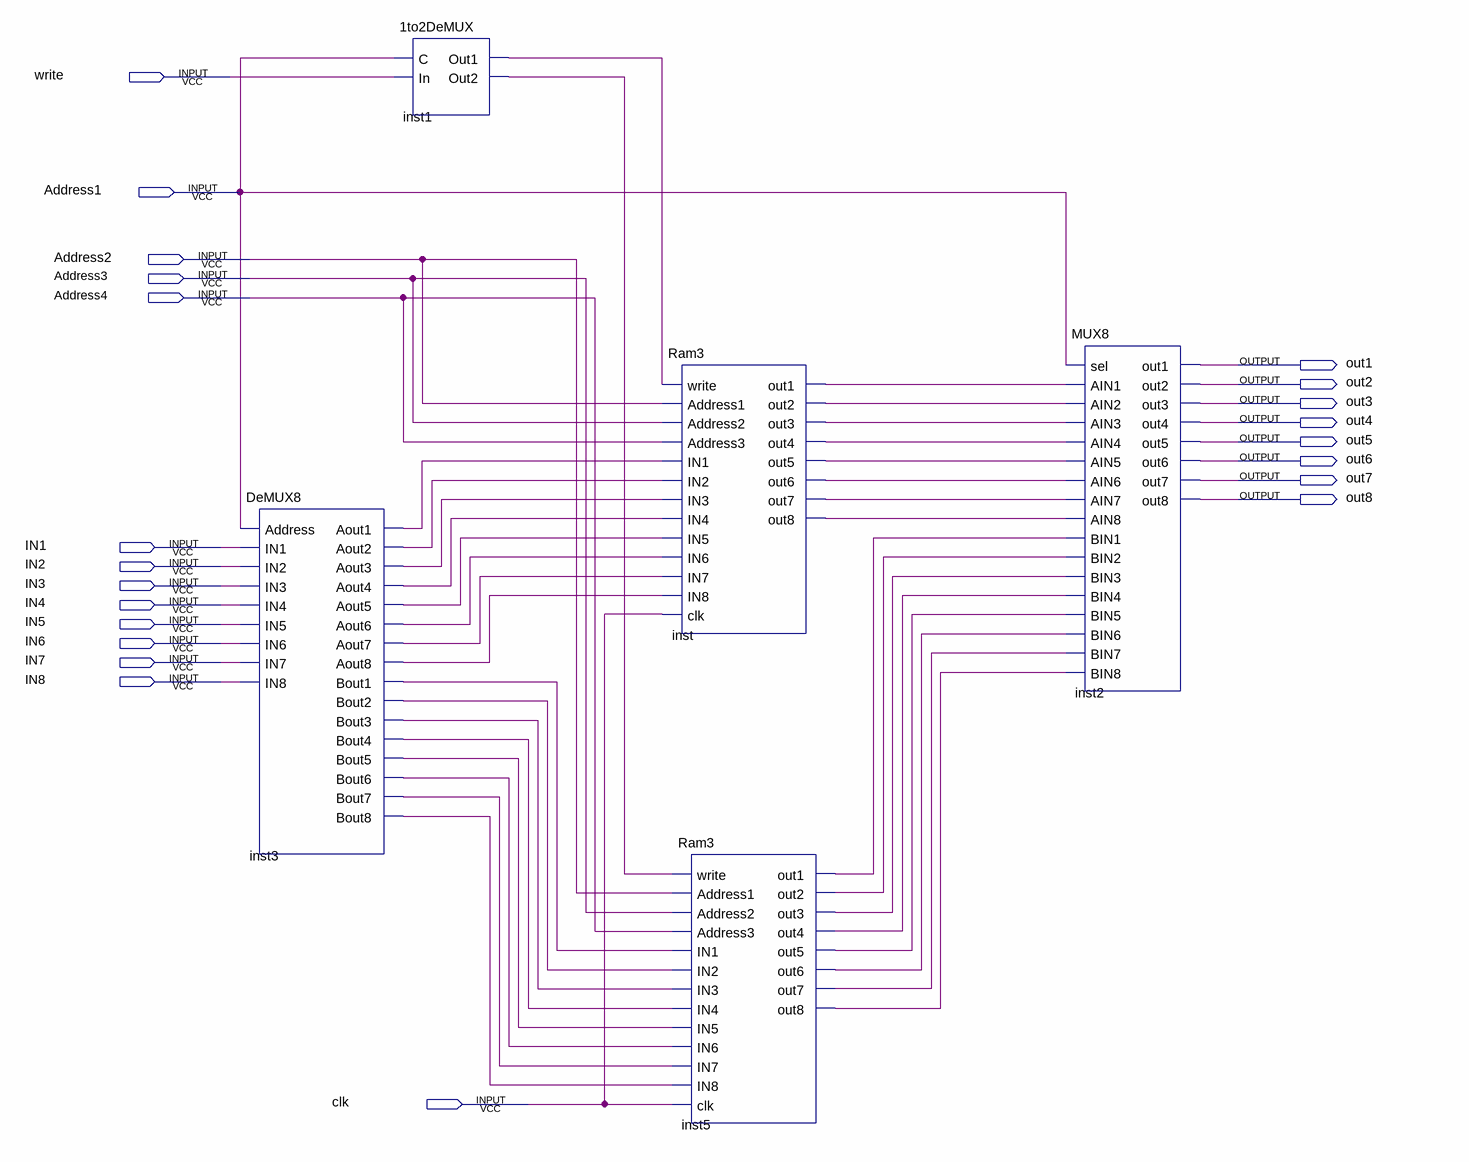
[diagram p0: schematic sheet]
// Quartus schematic Ram4.bdf as structural Verilog: 5 symbols, 22 pins
module Ram4 (
  input  write,
  input  Address1,
  input  Address2,
  input  Address3,
  input  Address4,
  input  IN1,
  input  IN2,
  input  IN3,
  input  IN4,
  input  IN5,
  input  IN6,
  input  IN7,
  input  IN8,
  input  clk,
  output out1,
  output out2,
  output out3,
  output out4,
  output out5,
  output out6,
  output out7,
  output out8
);

  wire inst1_out1, inst1_out2, inst3_aout1, inst3_aout2, inst3_aout3, inst3_aout4, inst3_aout5, inst3_aout6,
       inst3_aout7, inst3_aout8, inst3_bout1, inst3_bout2, inst3_bout3, inst3_bout4, inst3_bout5,
       inst3_bout6, inst3_bout7, inst3_bout8, inst5_out1, inst5_out2, inst5_out3, inst5_out4, inst5_out5,
       inst5_out6, inst5_out7, inst5_out8, inst_out1, inst_out2, inst_out3, inst_out4, inst_out5, inst_out6,
       inst_out7, inst_out8;

  DeMUX8 inst3 (
    .Address(Address1), .IN1(IN1), .IN2(IN2), .IN3(IN3), .IN4(IN4), .IN5(IN5), .IN6(IN6), .IN7(IN7),
    .IN8(IN8), .Aout1(inst3_aout1), .Aout2(inst3_aout2), .Aout3(inst3_aout3), .Aout4(inst3_aout4),
    .Aout5(inst3_aout5), .Aout6(inst3_aout6), .Aout7(inst3_aout7), .Aout8(inst3_aout8), .Bout1(inst3_bout1),
    .Bout2(inst3_bout2), .Bout3(inst3_bout3), .Bout4(inst3_bout4), .Bout5(inst3_bout5), .Bout6(inst3_bout6),
    .Bout7(inst3_bout7), .Bout8(inst3_bout8));
  \1to2DeMUX  inst1 (.C(Address1), .In(write), .Out1(inst1_out1), .Out2(inst1_out2));
  Ram3 inst (
    .write(inst1_out1), .Address1(Address2), .Address2(Address3), .Address3(Address4), .IN1(inst3_aout1),
    .IN2(inst3_aout2), .IN3(inst3_aout3), .IN4(inst3_aout4), .IN5(inst3_aout5), .IN6(inst3_aout6),
    .IN7(inst3_aout7), .IN8(inst3_aout8), .clk(clk), .out1(inst_out1), .out2(inst_out2), .out3(inst_out3),
    .out4(inst_out4), .out5(inst_out5), .out6(inst_out6), .out7(inst_out7), .out8(inst_out8));
  Ram3 inst5 (
    .write(inst1_out2), .Address1(Address2), .Address2(Address3), .Address3(Address4), .IN1(inst3_bout1),
    .IN2(inst3_bout2), .IN3(inst3_bout3), .IN4(inst3_bout4), .IN5(inst3_bout5), .IN6(inst3_bout6),
    .IN7(inst3_bout7), .IN8(inst3_bout8), .clk(clk), .out1(inst5_out1), .out2(inst5_out2), .out3(inst5_out3),
    .out4(inst5_out4), .out5(inst5_out5), .out6(inst5_out6), .out7(inst5_out7), .out8(inst5_out8));
  MUX8 inst2 (
    .sel(Address1), .AIN1(inst_out1), .AIN2(inst_out2), .AIN3(inst_out3), .AIN4(inst_out4), .AIN5(inst_out5),
    .AIN6(inst_out6), .AIN7(inst_out7), .AIN8(inst_out8), .BIN1(inst5_out1), .BIN2(inst5_out2),
    .BIN3(inst5_out3), .BIN4(inst5_out4), .BIN5(inst5_out5), .BIN6(inst5_out6), .BIN7(inst5_out7),
    .BIN8(inst5_out8), .out1(out1), .out2(out2), .out3(out3), .out4(out4), .out5(out5), .out6(out6),
    .out7(out7), .out8(out8));
endmodule
